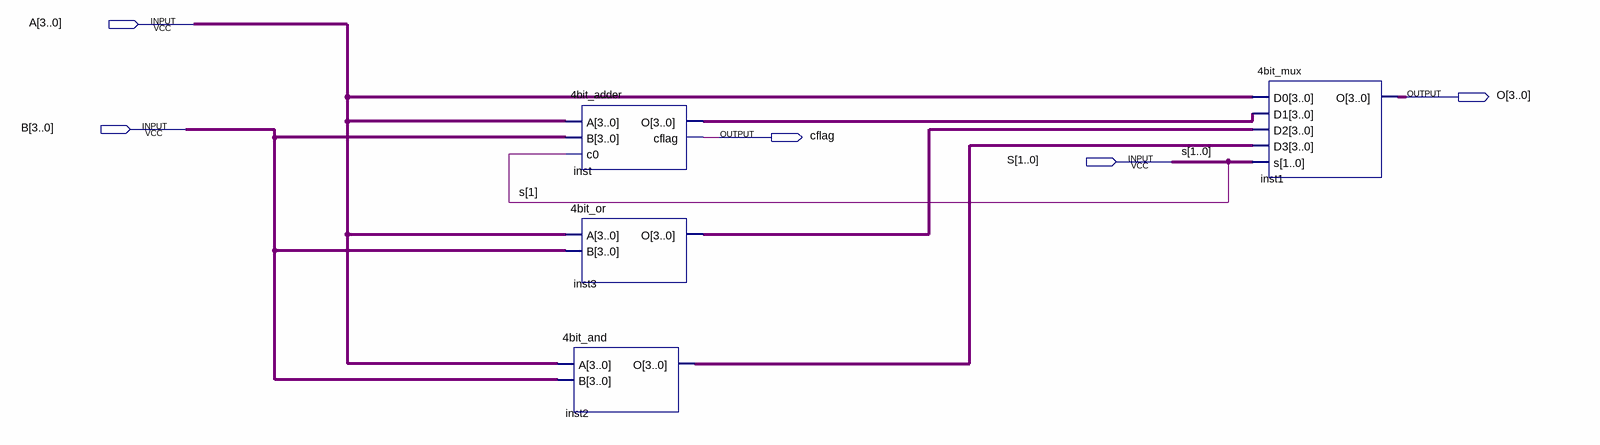
[diagram p0: schematic sheet]
// Quartus schematic alu_core.bdf as structural Verilog: 4 symbols, 5 pins
module alu_core (
  input  [3:0] A,
  input  [3:0] B,
  input  [1:0] S,
  output [3:0] O,
  output cflag
);

  wire [3:0] inst2_o, inst3_o, inst_o;

  \4bit_adder  inst (.A(A), .B(B), .c0(S[1]), .O(inst_o), .cflag(cflag));
  \4bit_or  inst3 (.A(A), .B(B), .O(inst3_o));
  \4bit_and  inst2 (.A(A), .B(B), .O(inst2_o));
  \4bit_mux  inst1 (.D0(A), .D1(inst_o), .D2(inst3_o), .D3(inst2_o), .s(S), .O(O));
endmodule
